# Altium schematic sheet Top.SchDoc
size A3; SheetNumber: 1; SheetTotal: 6
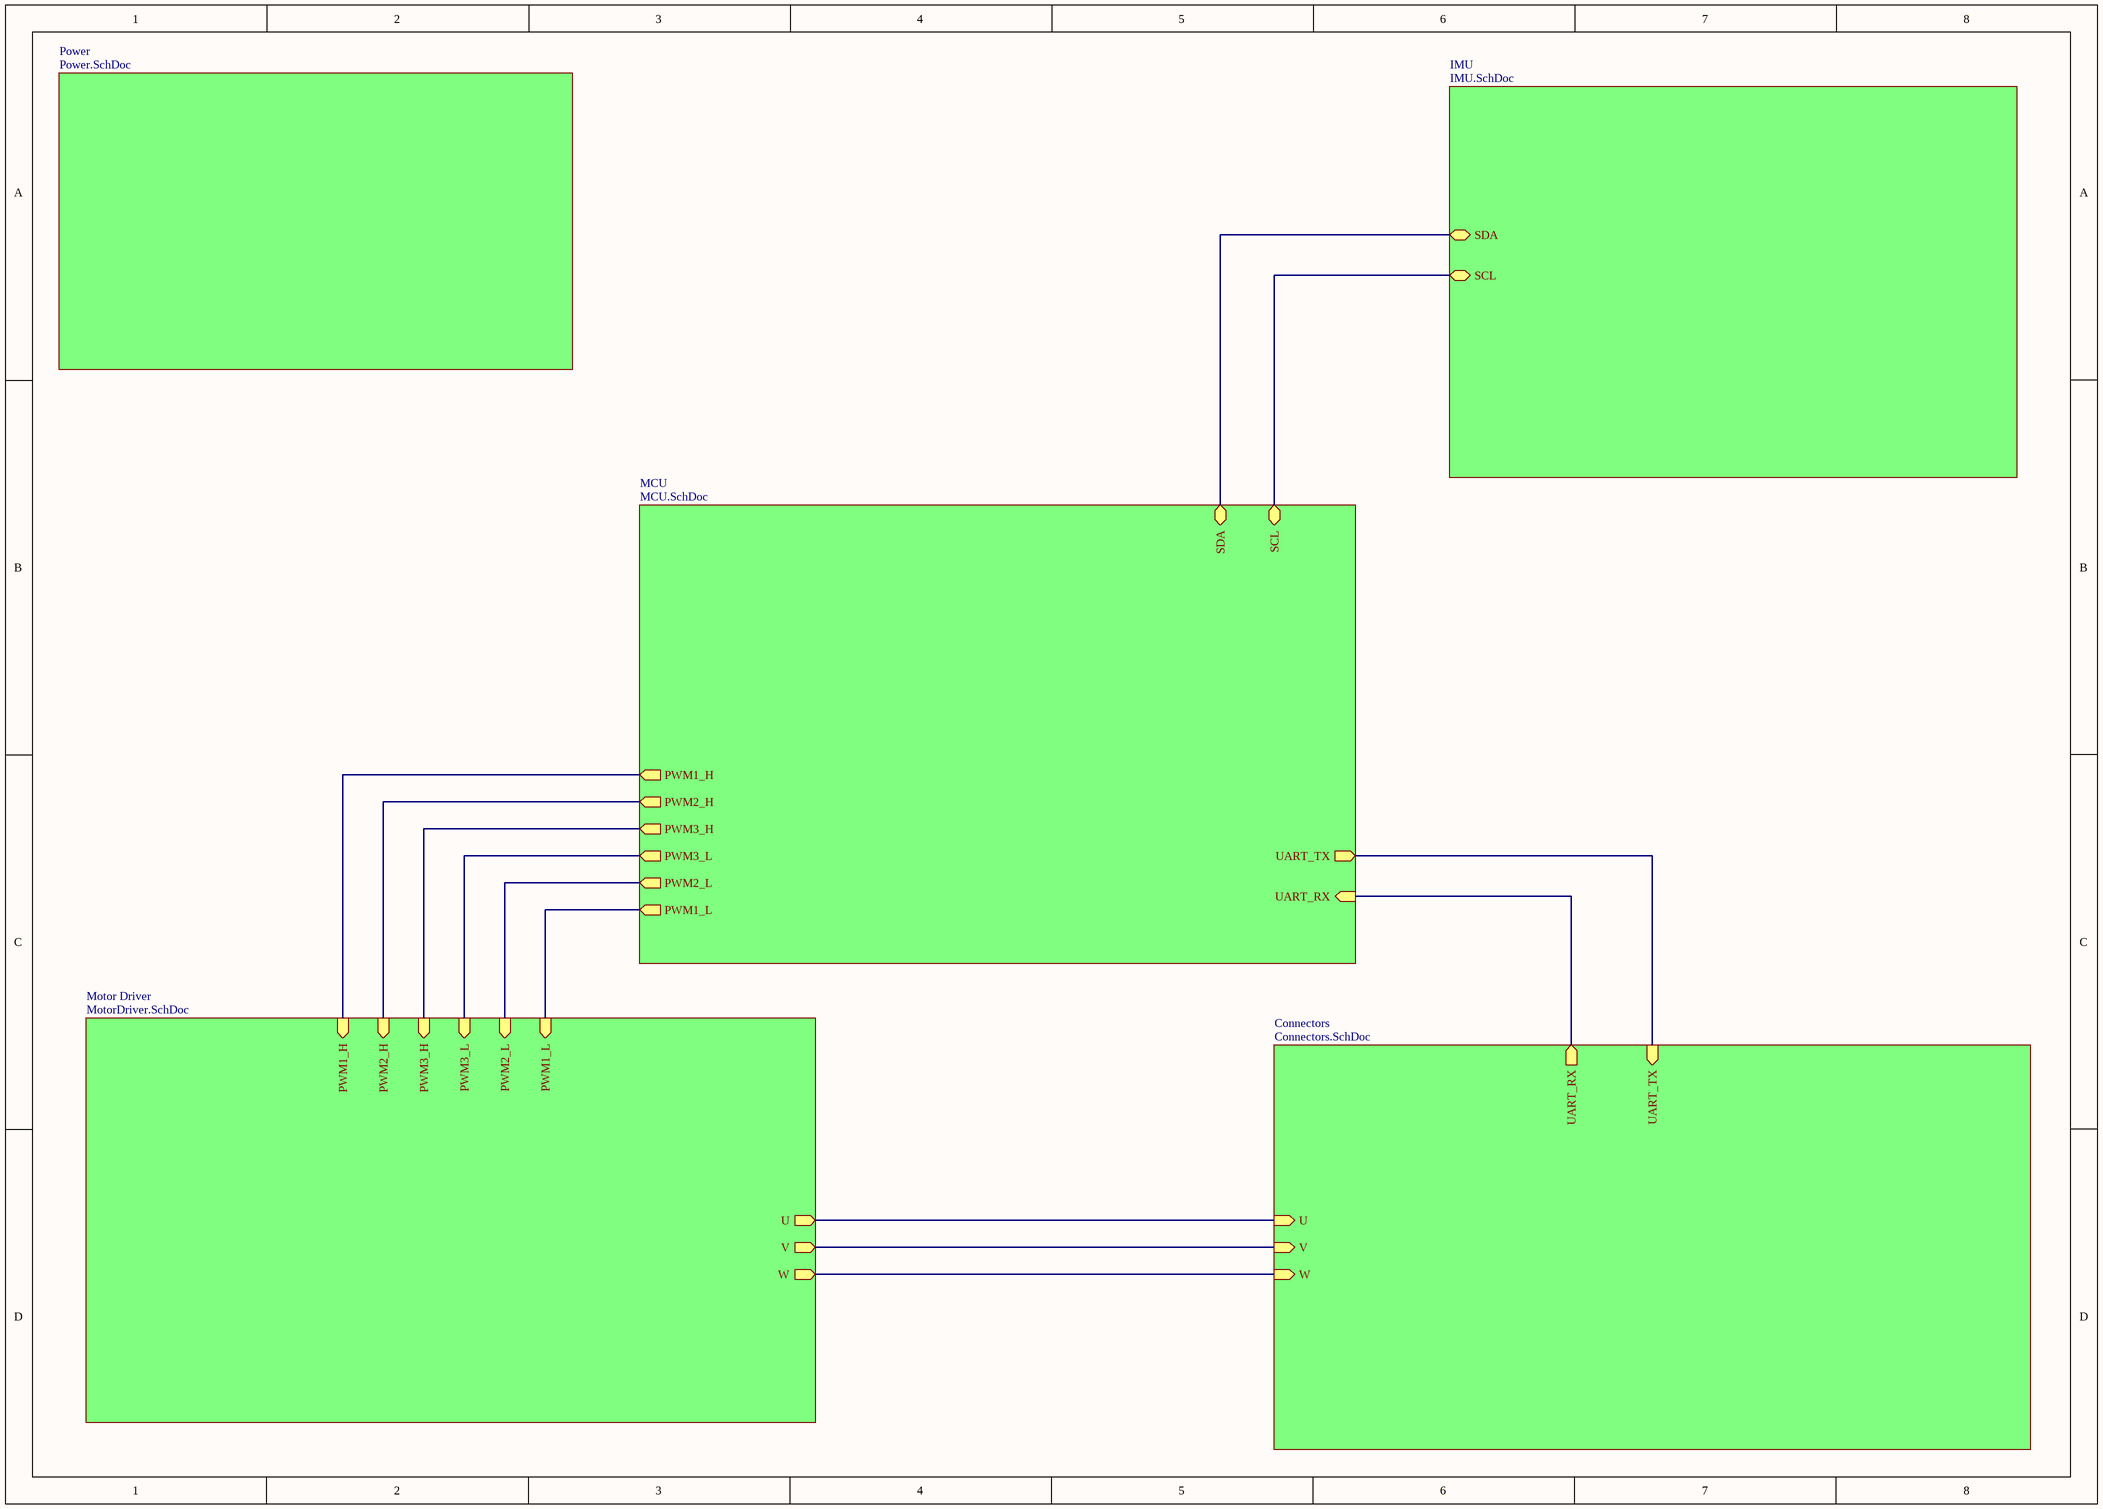
[diagram p0: Top.SchDoc]

## Sub-sheets
Connectors = Connectors.SchDoc: UART_TX (in), W (in), UART_RX (out), V (in), U (in)
IMU = IMU.SchDoc: SCL (bidir), SDA (bidir)
MCU = MCU.SchDoc: SCL (bidir), UART_TX (out), SDA (bidir), PWM1_L (out), PWM2_L (out), PWM3_L (out), PWM3_H (out), PWM2_H (out), PWM1_H (out), UART_RX (in)
Motor Driver = MotorDriver.SchDoc: W (out), PWM1_L (in), PWM2_L (in), PWM3_L (in), PWM3_H (in), PWM2_H (in), PWM1_H (in), V (out), U (out)
Power = Power.SchDoc: no entries

## Nets
(unnamed): sheet IMU/SCL, sheet MCU/SCL
(unnamed): sheet IMU/SDA, sheet MCU/SDA
(unnamed): sheet MCU/UART_TX, sheet Connectors/UART_TX
(unnamed): sheet MCU/PWM1_L, sheet Motor Driver/PWM1_L
(unnamed): sheet MCU/PWM2_L, sheet Motor Driver/PWM2_L
(unnamed): sheet MCU/PWM3_L, sheet Motor Driver/PWM3_L
(unnamed): sheet MCU/PWM3_H, sheet Motor Driver/PWM3_H
(unnamed): sheet MCU/PWM2_H, sheet Motor Driver/PWM2_H
(unnamed): sheet MCU/PWM1_H, sheet Motor Driver/PWM1_H
(unnamed): sheet MCU/UART_RX, sheet Connectors/UART_RX
(unnamed): sheet Motor Driver/W, sheet Connectors/W
(unnamed): sheet Motor Driver/V, sheet Connectors/V
(unnamed): sheet Motor Driver/U, sheet Connectors/U